# Altium schematic sheet DSP_R.SchDoc: EMRT MAIN CONTROLLER
size B; DrawnBy: HUST; DocumentNumber: 9321-E-1101; Revision: Rev.B; SheetNumber: 2; SheetTotal: 4; PageSetup: Record=PageOptions|CenterHorizontal=True|CenterVertical=True|PrintScale=0.96|XCorrection=1.00|YCorrection=1.00|PrintKind=1|BorderSize=5000000|LeftOffset=0|BottomOffset=0|Orientation=2|PaperLength=1000|PaperWidth=1000|Scale=100|PaperSource=7|PrintQuality=1200|MediaType=0|DitherType=0|PaperKind=A4|PrintScaleMode=1
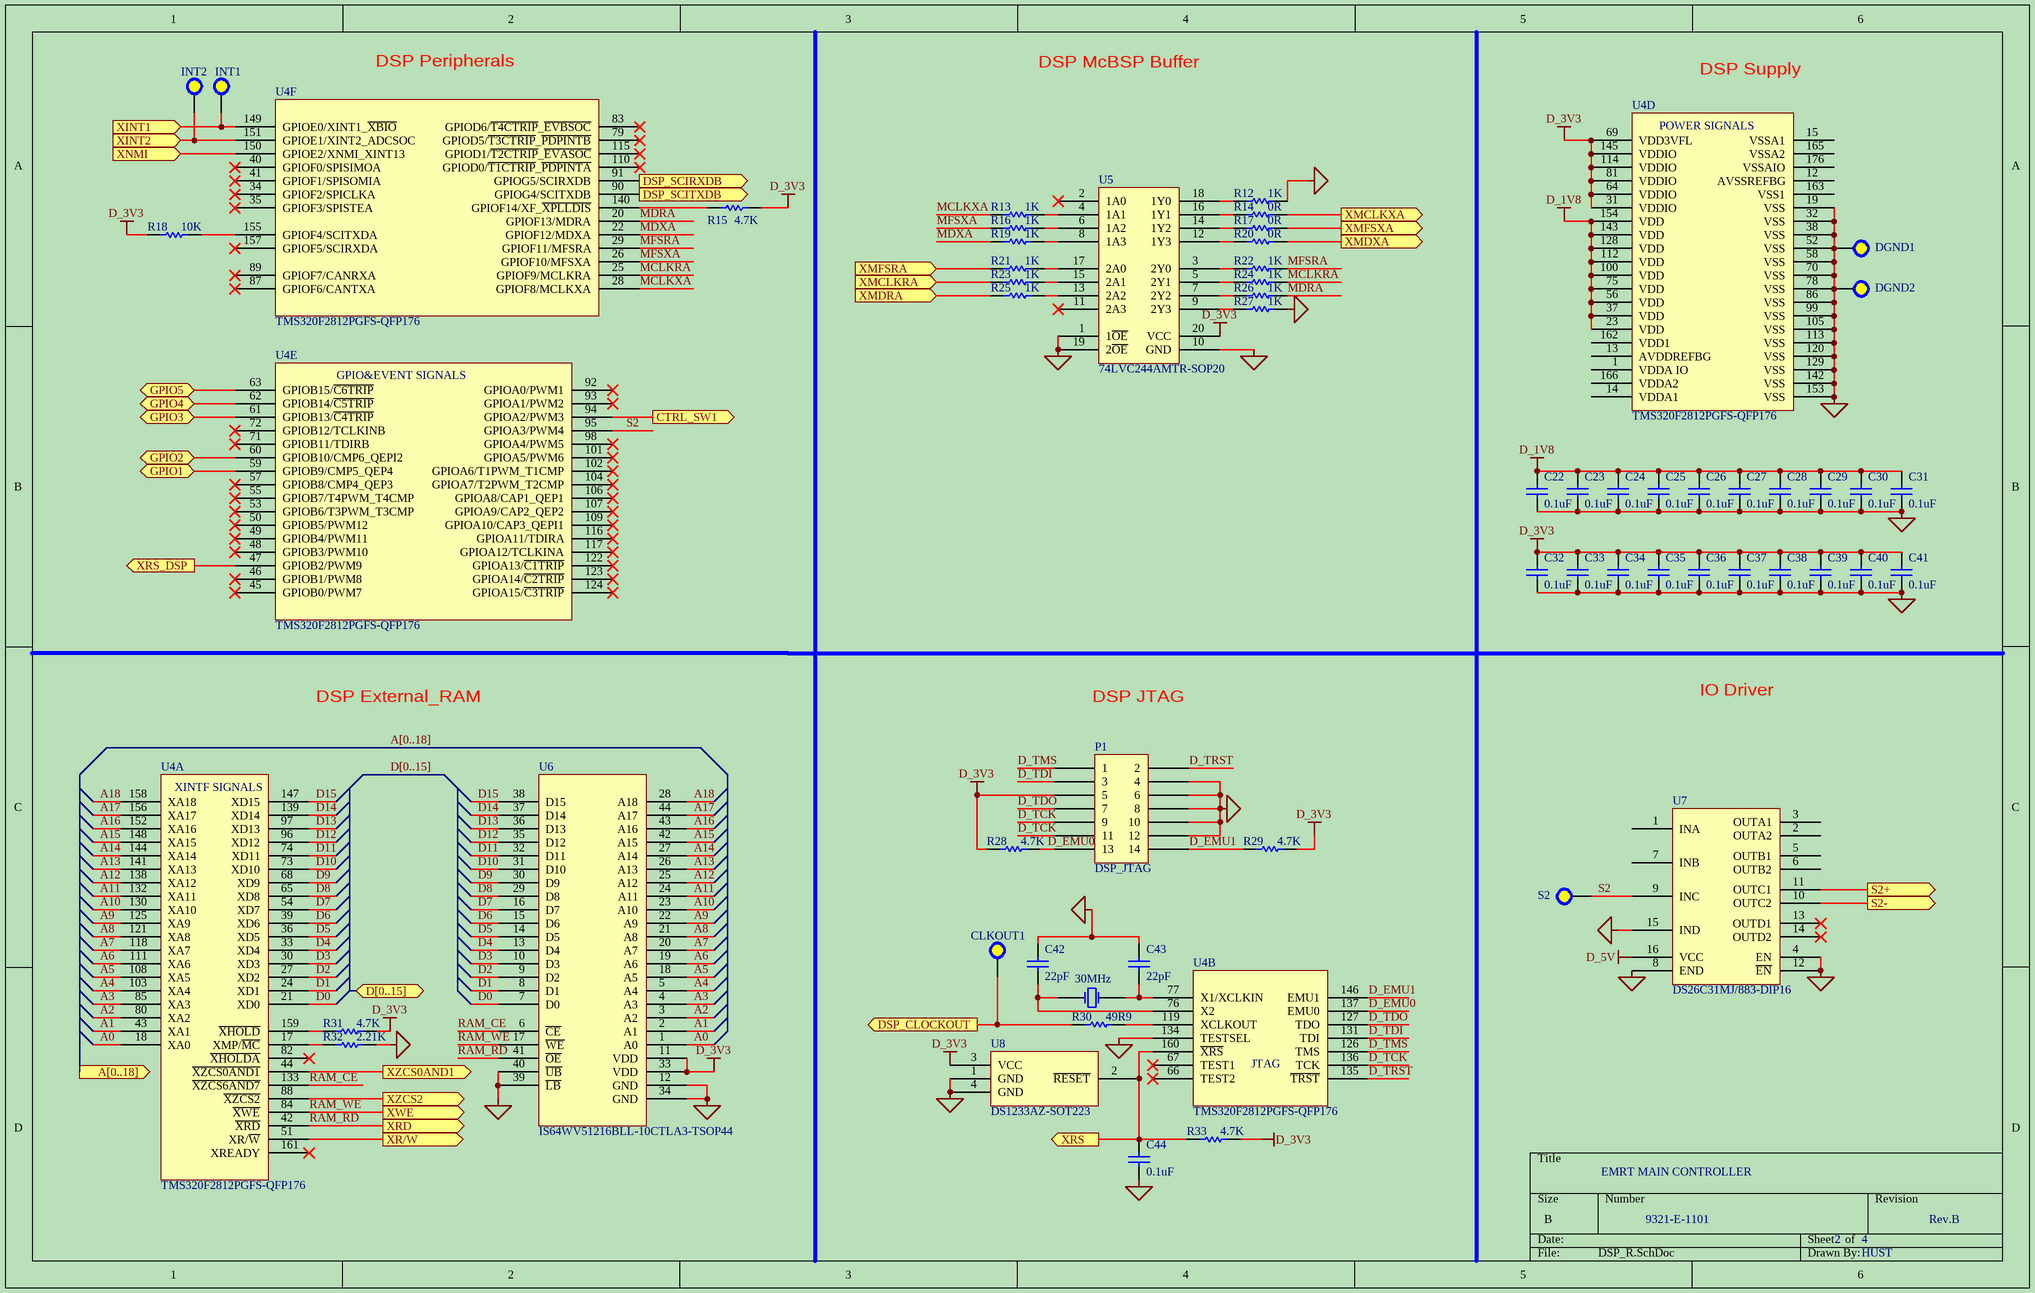
[diagram p0: DSP_R.SchDoc]

## Parts
C22  value 0.1uF  [CAPS0805_57]  (hidden comment: Cap)
C23  value 0.1uF  [CAPS0805_57]  (hidden comment: Cap)
C24  value 0.1uF  [CAPS0805_57]  (hidden comment: Cap)
C25  value 0.1uF  [CAPS0805_57]  (hidden comment: Cap)
C26  value 0.1uF  [CAPS0805_57]  (hidden comment: Cap)
C27  value 0.1uF  [CAPS0805_57]  (hidden comment: Cap)
C28  value 0.1uF  [CAPS0805_57]  (hidden comment: Cap)
C29  value 0.1uF  [CAPS0805_57]  (hidden comment: Cap)
C30  value 0.1uF  [CAPS0805_57]  (hidden comment: Cap)
C31  value 0.1uF  [CAPS0805_57]  (hidden comment: Cap)
C32  value 0.1uF  [CAPS0805_57]  (hidden comment: Cap)
C33  value 0.1uF  [CAPS0805_57]  (hidden comment: Cap)
C34  value 0.1uF  [CAPS0805_57]  (hidden comment: Cap)
C35  value 0.1uF  [CAPS0805_57]  (hidden comment: Cap)
C36  value 0.1uF  [CAPS0805_57]  (hidden comment: Cap)
C37  value 0.1uF  [CAPS0805_57]  (hidden comment: Cap)
C38  value 0.1uF  [CAPS0805_57]  (hidden comment: Cap)
C39  value 0.1uF  [CAPS0805_57]  (hidden comment: Cap)
C40  value 0.1uF  [CAPS0805_57]  (hidden comment: Cap)
C41  value 0.1uF  [CAPS0805_57]  (hidden comment: Cap)
C42  value 22pF  [CAPS0805_57]  (hidden comment: Cap)
C43  value 22pF  [CAPS0805_57]  (hidden comment: Cap)
C44  value 0.1uF  [CAPS0805_57]  (hidden comment: Cap)
CLKOUT1  TEST_SMALL  [test_small]  (value not drawn)
DGND1  TST_LARGE  [test_large]  (value not drawn)
DGND2  TST_LARGE  [test_large]  (value not drawn)
INT1  TEST_SMALL  [test_small]  (value not drawn)
INT2  TEST_SMALL  [test_small]  (value not drawn)
P1  DSP_JTAG  [HDR2X7]
R12  value 1K  [RESS0805]  (hidden comment: Res)
R13  value 1K  [RESS0805]  (hidden comment: Res)
R14  value 0R  [RESS0805]  (hidden comment: Res)
R15  value 4.7K  [RESS0805]  (hidden comment: Res)
R16  value 1K  [RESS0805]  (hidden comment: Res)
R17  value 0R  [RESS0805]  (hidden comment: Res)
R18  value 10K  [RESS0805]  (hidden comment: Res)
R19  value 1K  [RESS0805]  (hidden comment: Res)
R20  value 0R  [RESS0805]  (hidden comment: Res)
R21  value 1K  [RESS0805]  (hidden comment: Res)
R22  value 1K  [RESS0805]  (hidden comment: Res)
R23  value 1K  [RESS0805]  (hidden comment: Res)
R24  value 1K  [RESS0805]  (hidden comment: Res)
R25  value 1K  [RESS0805]  (hidden comment: Res)
R26  value 1K  [RESS0805]  (hidden comment: Res)
R27  value 1K  [RESS0805]  (hidden comment: Res)
R28  value 4.7K  [RESS0805]  (hidden comment: Res)
R29  value 4.7K  [RESS0805]  (hidden comment: Res)
R30  value 49R9  [RESS0805]  (hidden comment: Res)
R31  value 4.7K  [RESS0805]  (hidden comment: Res)
R32  value 2.21K  [RESS0805]  (hidden comment: Res)
R33  value 4.7K  [RESS0805]  (hidden comment: Res)
S2  TST_LARGE  [test_large]  (value not drawn)
U4  TMS320F2812PGFS-QFP176  [QFP176]  (parts A,B,D,E,F of 6)
U5  74LVC244AMTR-SOP20  [B-PDSO_20q1280×1030×265_p127]
U6  IS64WV51216BLL-10CTLA3-TSOP44  [TSOP44]
U7  DS26C31MJ/883-DIP16  [CDIP_16q785×305×200_d18_p100_i300]
U8  DS1233AZ-SOT223  [PDSO_3q700×650×180_p230]
Y1  XTAL  [XTALBCY_2q311×126×236_d13_p150]  (value not drawn)

## Ports
A[0..18] (out), CTRL_SW1 (out), D[0..15] (bidir), DSP_CLOCKOUT (out), DSP_SCIRXDB (in), DSP_SCITXDB (out), GPIO1 (bidir), GPIO2 (bidir), GPIO3 (bidir), GPIO4 (bidir), GPIO5 (bidir), S2+ (out), S2- (out), XINT1 (in), XINT2 (in), XMCLKRA (in), XMCLKXA (out), XMDRA (in), XMDXA (out), XMFSRA (in), XMFSXA (out), XNMI (in), XR/W (out), XRD (out), XRS (out), XRS_DSP (out), XWE (out), XZCS0AND1 (out), XZCS2 (out)

## Nets
D_1V8: C22.2 C23.2 C24.2 C25.2 C26.2 C27.2 C28.2 C29.2 C30.2 C31.2 U4.23(VDD) U4.37(VDD) U4.56(VDD) U4.75(VDD) U4.100(VDD) U4.112(VDD) U4.128(VDD) U4.143(VDD) U4.154(VDD)
D_3V3: C32.2 C33.2 C34.2 C35.2 C36.2 C37.2 C38.2 C39.2 C40.2 C41.2 P1.5 R15.1 R18.2 R28.2 R29.1 R31.1 R33.1 U4.31(VDDIO) U4.64(VDDIO) U4.69(VDD3VFL) U4.81(VDDIO) U4.114(VDDIO) U4.145(VDDIO) U5.20(VCC) U6.11(VDD) U6.33(VDD) U8.3(VCC)
D_5V: U7.16(VCC)
DGND: C22.1 C23.1 C24.1 C25.1 C26.1 C27.1 C28.1 C29.1 C30.1 C31.1 C32.1 C33.1 C34.1 C35.1 C36.1 C37.1 C38.1 C39.1 C40.1 C41.1 C42.2 C43.2 C44.1 DGND1.1 DGND2.1 P1.4 P1.6 P1.8 P1.10 P1.12 R12.1 R27.1 R32.1 U4.19(VSS) U4.32(VSS) U4.38(VSS) U4.52(VSS) U4.58(VSS) U4.70(VSS) U4.78(VSS) U4.86(VSS) U4.99(VSS) U4.105(VSS) U4.113(VSS) U4.120(VSS) U4.129(VSS) U4.134(TESTSEL) U4.142(VSS) U4.153(VSS) U5.1(1~{OE}) U5.10(GND) U5.19(2~{OE}) U6.12(GND) U6.34(GND) U6.39(~{LB}) U6.40(~{UB}) U7.4(EN) U7.8(END) U7.12(~{EN}) U7.15(IND) U8.1(GND) U8.4(GND)
A0: U4.18(XA0) U6.1(A0)
A1: U4.43(XA1) U6.2(A1)
A2: U4.80(XA2) U6.3(A2)
A3: U4.85(XA3) U6.4(A3)
A4: U4.103(XA4) U6.5(A4)
A5: U4.108(XA5) U6.18(A5)
A6: U4.111(XA6) U6.19(A6)
A7: U4.118(XA7) U6.20(A7)
A8: U4.121(XA8) U6.21(A8)
A9: U4.125(XA9) U6.22(A9)
A10: U4.130(XA10) U6.23(A10)
A11: U4.132(XA11) U6.24(A11)
A12: U4.138(XA12) U6.25(A12)
A13: U4.141(XA13) U6.26(A13)
A14: U4.144(XA14) U6.27(A14)
A15: U4.148(XA15) U6.42(A15)
A16: U4.152(XA16) U6.43(A16)
A17: U4.156(XA17) U6.44(A17)
A18: U4.158(XA18) U6.28(A18)
CTRL_SW1: U4.94(GPIOA2/PWM3) ; port CTRL_SW1
D0: U4.21(XD0) U6.7(D0)
D1: U4.24(XD1) U6.8(D1)
D2: U4.27(XD2) U6.9(D2)
D3: U4.30(XD3) U6.10(D3)
D4: U4.33(XD4) U6.13(D4)
D5: U4.36(XD5) U6.14(D5)
D6: U4.39(XD6) U6.15(D6)
D7: U4.54(XD7) U6.16(D7)
D8: U4.65(XD8) U6.29(D8)
D9: U4.68(XD9) U6.30(D9)
D10: U4.73(XD10) U6.31(D10)
D11: U4.74(XD11) U6.32(D11)
D12: U4.96(XD12) U6.35(D12)
D13: U4.97(XD13) U6.36(D13)
D14: U4.139(XD14) U6.37(D14)
D15: U4.147(XD15) U6.38(D15)
D_EMU0: P1.13 R28.1 U4.137(EMU0)
D_EMU1: P1.14 R29.2 U4.146(EMU1)
D_TCK: P1.9 P1.11 U4.136(TCK)
D_TDI: P1.3 U4.131(TDI)
D_TDO: P1.7 U4.127(TDO)
D_TMS: P1.1 U4.126(TMS)
D_TRST: P1.2 U4.135(~{TRST})
DSP_CLOCKOUT: CLKOUT1.1 R30.2 ; port DSP_CLOCKOUT
DSP_SCIRXDB: U4.91(GPIOG5/SCIRXDB) ; port DSP_SCIRXDB
DSP_SCITXDB: U4.90(GPIOG4/SCITXDB) ; port DSP_SCITXDB
GPIO1: U4.59(GPIOB9/CMP5_QEP4) ; port GPIO1
GPIO2: U4.60(GPIOB10/CMP6_QEPI2) ; port GPIO2
GPIO3: U4.61(GPIOB13/~{C4TRIP}) ; port GPIO3
GPIO4: U4.62(GPIOB14/~{C5TRIP}) ; port GPIO4
GPIO5: U4.63(GPIOB15/~{C6TRIP}) ; port GPIO5
MCLKRA: R24.1 U4.25(GPIOF9/MCLKRA)
MCLKXA: R13.2 U4.28(GPIOF8/MCLKXA)
MDRA: R26.1 U4.20(GPIOF13/MDRA)
MDXA: R19.2 U4.22(GPIOF12/MDXA)
MFSRA: R22.1 U4.29(GPIOF11/MFSRA)
MFSXA: R16.2 U4.26(GPIOF10/MFSXA)
RAM_CE: U4.133(~{XZCS6AND7}) U6.6(~{CE})
RAM_RD: U4.42(~{XRD}) U6.41(~{OE}) ; port XRD
RAM_WE: U4.84(~{XWE}) U6.17(~{WE}) ; port XWE
S2: S2.1 U4.95(GPIOA3/PWM4) U7.9(INC)
S2+: U7.11(OUTC1) ; port S2+
S2-: U7.10(OUTC2) ; port S2-
XINT1: INT1.1 U4.149(GPIOE0/XINT1_~{XBIO}) ; port XINT1
XINT2: INT2.1 U4.151(GPIOE1/XINT2_ADCSOC) ; port XINT2
XMCLKRA: R23.2 ; port XMCLKRA
XMCLKXA: R14.1 ; port XMCLKXA
XMDRA: R25.2 ; port XMDRA
XMDXA: R20.1 ; port XMDXA
XMFSRA: R21.2 ; port XMFSRA
XMFSXA: R17.1 ; port XMFSXA
XNMI: U4.150(GPIOE2/XNMI_XINT13) ; port XNMI
XR/W: U4.51(XR/~{W}) ; port XR/W
XRS: C44.2 R33.2 U4.160(~{XRS}) U8.2(~{RESET}) ; port XRS
XRS_DSP: U4.47(GPIOB2/PWM9) ; port XRS_DSP
XZCS0AND1: U4.44(~{XZCS0AND1}) ; port XZCS0AND1
XZCS2: U4.88(~{XZCS2}) ; port XZCS2
NetC42_1: C42.1 U4.76(X2) Y1.2(OSC2)
NetC43_1: C43.1 U4.77(X1/XCLKIN) Y1.1(OSC1)
NetR12_2: R12.2 U5.18(1Y0)
NetR13_1: R13.1 U5.4(1A1)
NetR14_2: R14.2 U5.16(1Y1)
NetR15_2: R15.2 U4.140(GPIOF14/XF_~{XPLLDIS})
NetR16_1: R16.1 U5.6(1A2)
NetR17_2: R17.2 U5.14(1Y2)
NetR18_1: R18.1 U4.155(GPIOF4/SCITXDA)
NetR19_1: R19.1 U5.8(1A3)
NetR20_2: R20.2 U5.12(1Y3)
NetR21_1: R21.1 U5.17(2A0)
NetR22_2: R22.2 U5.3(2Y0)
NetR23_1: R23.1 U5.15(2A1)
NetR24_2: R24.2 U5.5(2Y1)
NetR25_1: R25.1 U5.13(2A2)
NetR26_2: R26.2 U5.7(2Y2)
NetR27_2: R27.2 U5.9(2Y3)
NetR30_1: R30.1 U4.119(XCLKOUT)
NetR31_2: R31.2 U4.159(~{XHOLD})
NetR32_2: R32.2 U4.17(XMP/~{MC})

Not connected (* = marked no-connect by the designer): U4 1(VDDA_IO) 12(AVSSREFBG) 13(AVDDREFBG) 14(VDDA1) 15(VSSA1) 34(GPIOF2/SPICLKA)* 35(GPIOF3/SPISTEA)* 40(GPIOF0/SPISIMOA)* 41(GPIOF1/SPISOMIA)* 45(GPIOB0/PWM7)* 46(GPIOB1/PWM8)* 48(GPIOB3/PWM10)* 49(GPIOB4/PWM11)* 50(GPIOB5/PWM12)* 53(GPIOB6/T3PWM_T3CMP)* 55(GPIOB7/T4PWM_T4CMP)* 57(GPIOB8/CMP4_QEP3)* 66(TEST2)* 67(TEST1)* 71(GPIOB11/TDIRB)* 72(GPIOB12/TCLKINB)* 79(GPIOD5/~{T3CTRIP}_~{PDPINTB})* 82(~{XHOLDA})* 83(GPIOD6/~{T4CTRIP}_~{EVBSOC})* 87(GPIOF6/CANTXA)* 89(GPIOF7/CANRXA)* 92(GPIOA0/PWM1)* 93(GPIOA1/PWM2)* 98(GPIOA4/PWM5)* 101(GPIOA5/PWM6)* 102(GPIOA6/T1PWM_T1CMP)* 104(GPIOA7/T2PWM_T2CMP)* 106(GPIOA8/CAP1_QEP1)* 107(GPIOA9/CAP2_QEP2)* 109(GPIOA10/CAP3_QEPI1)* 110(GPIOD0/~{T1CTRIP}_~{PDPINTA})* 115(GPIOD1/~{T2CTRIP}_~{EVASOC})* 116(GPIOA11/TDIRA)* 117(GPIOA12/TCLKINA)* 122(GPIOA13/~{C1TRIP})* 123(GPIOA14/~{C2TRIP})* 124(GPIOA15/~{C3TRIP})* 157(GPIOF5/SCIRXDA)* 161(XREADY)* 162(VDD1) 163(VSS1) 165(VSSA2) 166(VDDA2) 176(VSSAIO); U5 2(1A0)* 11(2A3)*; U7 1(INA) 2(OUTA2) 3(OUTA1) 5(OUTB1) 6(OUTB2) 7(INB) 13(OUTD1)* 14(OUTD2)*

## Buses and harness runs
bus A[0..18] = port A[0..18]
bus D[0..15] = port D[0..15]

## Notes on the sheet
- DSP Peripherals
- DSP McBSP Buffer
- DSP Supply
- DSP External_RAM
- DSP JTAG
- IO Driver
- (in symbol TMS320F2812(176PIN), part A) XINTF SIGNALS
- (in symbol TMS320F2812(176PIN), part B) JTAG
- (in symbol TMS320F2812(176PIN), part D) POWER SIGNALS
- (in symbol TMS320F2812(176PIN), part E) GPIO&EVENT SIGNALS
- (in symbol XTAL) 30MHz

## Library data of the parts
C22-C44 = Y20025084: Capacitor; 制造商型号: VJ0805H104KXA; parent: 01; 精度: ±10%; 描述: VISHAY;VJ0805H104KXA;0.1uF;±10%;50V;X8R;150℃;CAP0805; 安装形式: SMT; 湿敏等级（回流焊峰值）: 0; 产品外形尺寸<长>: 0.079±0.008 in; 产品外形尺寸<宽>: 0.049±0.008 in; 产品外形尺寸<高>: 0.057 in; id: wt.part.WTPartMaster:1053152; state: APPROVED; folder: /Default/电容/VJ0805H104KXA; Part Number: Y20025084; HelpURL: \\10.185.226.160\altium_center_db\DATASHEET\VISHAY VJ X8R.pdf; Library Path: Cap.SchLib; Library Ref: Cap; Footprint Path: VISHAY VJ0805_57.PcbLib; Footprint Ref: CAPS0805_57; pname: VJ0805H104KXA; Library Path 2: 0; Library Ref 2: 0; Footprint Path 2: 0; Footprint Ref 2: 0; Footprint Path 3: 0; Footprint Ref 3: 0
DGND1 DGND2 S2 = TEST_LARGE
R12-R33 = Res: Semiconductor Resistor; Manufacturer: Generic Components; Class: Passive; Published: 08/06/2000; Publisher: Altium Hobart Technology Centre; SubClass: Resistor
U4 = TMS320F2812(176PIN)
U5 = 74LVC244AMTR
U6 = IS61LV51216
U7 = DS26LVC31
U8 = DS1233AZ-15
Y1 = XTAL: Crystal Oscillator; Published: 8-Jun-2000; LatestRevisionDate: 17-Jul-2002; LatestRevisionNote: Re-released for DXP Platform.; Publisher: Altium Limited